# Altium project PWB.PrjPcb (part 2 of 3)

## Sheet EG8010.SchDoc: =DocumentName
size A4; Author: Starovit; CompanyName: "AS Manufacturing" LLC; Organization: "AS Manufacturing" LLC; Address1: 5 Sklyarenka St.; Address2: Kyiv 04073; Address3: Ukraine; Address4: https://ajax.systems/en/; Revision: v4; SheetNumber: 3; SheetTotal: 10; Product name: INVERTOR; Internal reference: 001; Head: INVERTOR.001.v4; PCB_Designator: INVERTOR.001.v4; Template_version: 1.0.1
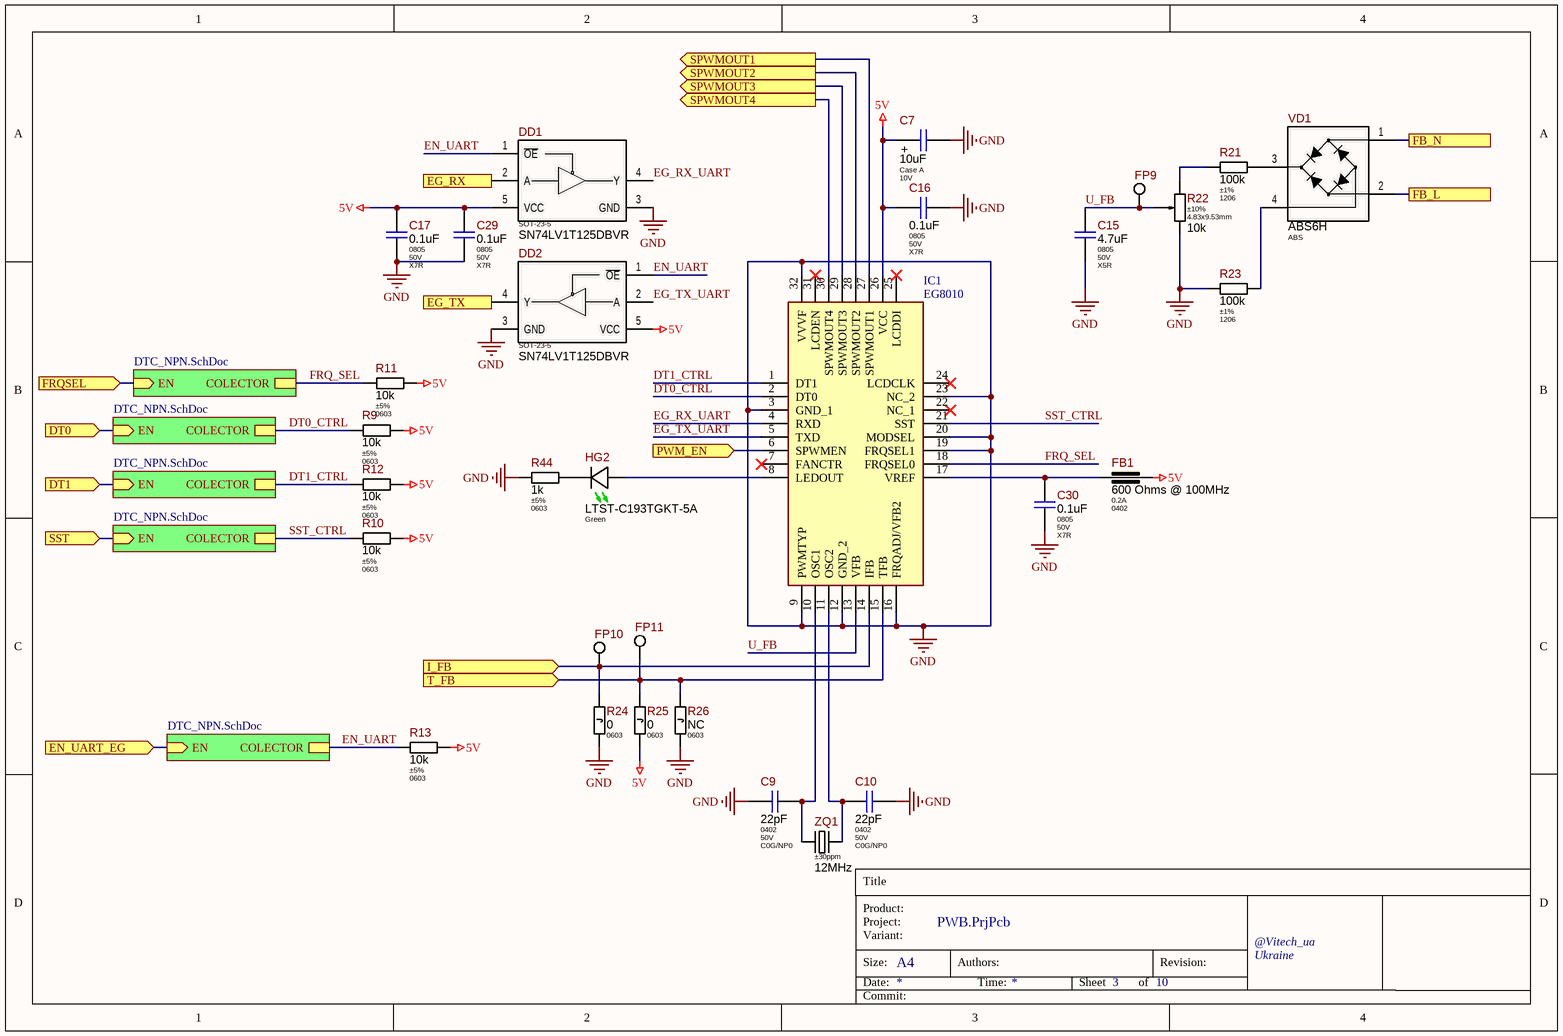
[diagram p2: EG8010.SchDoc]

### Parts
C7  Package: Case A  Voltage: 10V  [C_TANTAL_CASE_A_MED]  (hidden comment: 10uF)
C9  Package: 0402  Voltage: 50V  Dielectric Type: C0G/NP0  [C_CERAMIC_0402_MED]  (hidden comment: 22pF)
C10  Package: 0402  Voltage: 50V  Dielectric Type: C0G/NP0  [C_CERAMIC_0402_MED]  (hidden comment: 22pF)
C15  Package: 0805  Voltage: 50V  Dielectric Type: X5R  [C_CERAMIC_0805_MED]  (hidden comment: 4.7uF)
C16  Package: 0805  Voltage: 50V  Dielectric Type: X7R  [CAP-0805(2012)X85T10]  (hidden comment: 0.1uF)
C17  Package: 0805  Voltage: 50V  Dielectric Type: X7R  [CAP-0805(2012)X85T10]  (hidden comment: 0.1uF)
C29  Package: 0805  Voltage: 50V  Dielectric Type: X7R  [CAP-0805(2012)X85T10]  (hidden comment: 0.1uF)
C30  Package: 0805  Voltage: 50V  Dielectric Type: X7R  [CAP-0805(2012)X85T10]  (hidden comment: 0.1uF)
DD1  SN74LV1T125DBVR  [SOT-23-5]
DD2  SN74LV1T125DBVR  [SOT-23-5]
FB1  value 600 Ohms @ 100MHz  Current: 0.2A  Package: 0402  [BLM15xxxxxSN1x_MED]  (hidden comment: BLM15BD601SN1D)
FP9  PAD-1.75mm  [PAD-1.75mm]  (value not drawn)  (no BOM)
FP10  PAD-1.75mm  [PAD-1.75mm]  (value not drawn)  (no BOM)
FP11  PAD-1.75mm  [PAD-1.75mm]  (value not drawn)  (no BOM)
HG2  Color: Green  [LTST-C193xGKT-5A]  (hidden comment: LTST-C193TGKT-5A)
IC1  EG8010  [QFP80P900X900X160-32N]
R9  Tolerance: ±5%  Package: 0603  [R_ANY_CHIP_0603_MED]  (hidden comment: 10k)
R10  Tolerance: ±5%  Package: 0603  [R_ANY_CHIP_0603_MED]  (hidden comment: 10k)
R11  Tolerance: ±5%  Package: 0603  [R_ANY_CHIP_0603_MED]  (hidden comment: 10k)
R12  Tolerance: ±5%  Package: 0603  [R_ANY_CHIP_0603_MED]  (hidden comment: 10k)
R13  Tolerance: ±5%  Package: 0603  [R_ANY_CHIP_0603_MED]  (hidden comment: 10k)
R21  Tolerance: ±1%  Package: 1206  [R_ANY_CHIP_1206_MED]  (hidden comment: 100k)
R22  Tolerance: ±10%  Package: 4.83x9.53mm  [3296W-1-xxx]  (hidden comment: 10k)
R23  Tolerance: ±1%  Package: 1206  [R_ANY_CHIP_1206_MED]  (hidden comment: 100k)
R24  Package: 0603  [R_ANY_CHIP_0603_MED]  (hidden comment: 0)
R25  Package: 0603  [R_ANY_CHIP_0603_MED]  (hidden comment: 0)
R26  Package: 0603  [R_ANY_CHIP_0603_MED]  (hidden comment: NC)
R44  Tolerance: ±5%  Package: 0603  [R_ANY_CHIP_0603_MED]  (hidden comment: 1k)
VD1  Package: ABS  [ABSxx-Series]  (hidden comment: ABS6H)
ZQ1  Frequency Tolerance: ±30ppm  Frequency: 12MHz  [CSM4-Series]  (hidden comment: CSM4Z-A2B3C3-40-12.0D18)

### Sub-sheets
OC = DTC_NPN.SchDoc: EN (in), COLECTOR
OC = DTC_NPN.SchDoc: EN (in), COLECTOR
OC = DTC_NPN.SchDoc: EN (in), COLECTOR
OC = DTC_NPN.SchDoc: EN (in), COLECTOR
OC = DTC_NPN.SchDoc: EN (in), COLECTOR

### Ports
DT0 (in), DT1 (in), EG_RX (in), EG_TX (out), EN_UART_EG (in), FB_L, FB_N, FRQSEL (in), I_FB (in), PWM_EN (in), SPWMOUT1 (out), SPWMOUT2 (out), SPWMOUT3 (out), SPWMOUT4 (out), SST (in), T_FB (in)

### Nets
5V: C7.1 C16.1 C17.1 C29.1 DD1.5(VCC) DD2.5(VCC) FB1.1 IC1.26(VCC) R9.2 R10.2 R11.2 R12.2 R13.2 R25.2
GND: C7.2 C9.1 C10.2 C15.2 C16.2 C17.2 C29.2 C30.2 DD1.3(GND) DD2.3(GND) IC1.3(GND_1) IC1.9(PWMTYP) IC1.12(GND_2) IC1.16(FRQADJ/VFB2) IC1.19(FRQSEL1) IC1.20(MODSEL) IC1.23(NC_2) IC1.32(VVVF) R22.1(CCW) R23.1 R24.2 R26.2 R44.1
cEN_UART_EG: port EN_UART_EG, sheet OC/EN
DT0: port DT0, sheet OC/EN
DT0_CTRL: IC1.2(DT0) R9.1 ; sheet OC/COLECTOR
DT1: port DT1, sheet OC/EN
DT1_CTRL: IC1.1(DT1) R12.1 ; sheet OC/COLECTOR
EG_RX: DD1.2(A) ; port EG_RX
EG_RX_UART: DD1.4(Y) IC1.4(RXD)
EG_TX: DD2.4(Y) ; port EG_TX
EG_TX_UART: DD2.2(A) IC1.5(TXD)
EN_PWM: IC1.6(SPWMEN) ; port PWM_EN
EN_UART: DD1.1(~{OE}) DD2.1(~{OE}) R13.1 ; sheet OC/COLECTOR
FQSEL: port FRQSEL, sheet OC/EN
FRQ_SEL: IC1.18(FRQSEL0) R11.1 ; sheet OC/COLECTOR
NEUTRAL: VD1.2 ; port FB_L
SST: port SST, sheet OC/EN
SST_CTRL: IC1.21(SST) R10.1 ; sheet OC/COLECTOR
TR_OUT_L: VD1.1 ; port FB_N
U_FB: C15.1 FP9.1 IC1.13(VFB) R22.2(WIPER)
NetC9_2: C9.2 IC1.10(OSC1) ZQ1.2(XTAL2)
NetC10_1: C10.1 IC1.11(OSC2) ZQ1.1(XTAL1)
NetC30_1: C30.1 FB1.2 IC1.17(VREF)
NetDD3_4: IC1.29(SPWMOUT3) ; port SPWMOUT3
NetDD3_7: IC1.30(SPWMOUT4) ; port SPWMOUT4
NetDD3_9: IC1.27(SPWMOUT1) ; port SPWMOUT1
NetDD3_12: IC1.28(SPWMOUT2) ; port SPWMOUT2
NetFP10_1: FP10.1 IC1.14(IFB) R24.1 ; port I_FB
NetFP11_1: FP11.1 IC1.15(TFB) R25.1 R26.1 ; port T_FB
NetHG2_AN: HG2.AN(Anode) IC1.8(LEDOUT)
NetHG2_CA: HG2.CA(Cathode) R44.2
NetR21_1: R21.1 R22.3(CW)
NetR21_2: R21.2 VD1.3(+)
NetR23_2: R23.2 VD1.4(-)

Not connected (* = marked no-connect by the designer): IC1 7(FANCTR)* 22(NC_1)* 24(LCDCLK)* 25(LCDDI)* 31(LCDEN)*

### Notes on the sheet
- Title
- Product:
- Project:
- Size:
- Date:
- Variant:
- A4
- Authors:
- Time:
- Sheet
- of
- Revision:
- @Vitech_ua
- Commit:
- (in symbol 293D106X9010A2TE3) +

### Library data of the parts
C7 = 293D106X9010A2TE3: 10uF 10V ±10% Case A Tantalum Capacitor RoHS, 3.4Ohm; Manufacturer: Vishay; Ajax_1C_ID: 58999; Ajax_1C_PN: 10uF 10V case A Vishay 293D106X9010A2TE3 Tantalum Capacitor SMD RoHS; Ajax_1С_Status: RND Only; Standard Lead Time: 20 Weeks; Component Status: Released; Dielectric Type: NONE; GUID_1C: 304cf5a9-8da3-11ed-a366-005056994834; Value: 10uF; Part Number: 293D106X9010A2TE3; Part Type: Tantalum; Component Type: SMD; Temperature Range: -55°C ~ 125°C; Tolerance: ±10%; ComponentLink1URL: https://eu.mouser.com/datasheet/2/427/293d-1763499.pdf; Supplier 1: Mouser; Supplier Part Number 1: 74-293D106X9010A2TE3; Replacement: NONE; Price: 0,1; ComponentLink1Description: Datasheet
C9 C10 = CL05C220JB5NNNC: 22pF 50V NP0, C0G ±5% 0402 Ceramic Capacitor RoHS; Manufacturer: Samsung Electro-Mechanics; Ajax_1C_ID: 26744; Ajax_1C_PN: 22pF 50V COG 5% 0402 Samsung CL05C220JB5NNNC Ceramic Capacitor SMD RoHS; Ajax_1С_Status: Substitution; Standard Lead Time: 22 Weeks; Component Status: Released; Replacement: NONE; GUID_1C: 5b73e2ce-71ce-11eb-ab70-0050569f2651; Value: 22pF; Part Number: CL05C220JB5NNNC; Part Type: Ceramic / C0G(NP0) / 0402; Component Type: SMD; Temperature Range: -55°C ~ 125°C; Tolerance: ±5%; ComponentLink1URL: https://media.digikey.com/pdf/Data%20Sheets/Samsung%20PDFs/CL_Series_MLCC_ds.pdf; Supplier 1: Digi-Key; Supplier Part Number 1: 1276-1116-2-ND; Price: 0,0034; ComponentLink1Description: Datasheet
C15 = GRM21BR61H475KE51L: 4.7uF 50V X5R ±10% 0805 Ceramic Capacitor RoHS; Manufacturer: Murata Electronics; Ajax_1C_ID: 10966; Ajax_1C_PN: 4.7uF 50V X5R 10% 0805 GRM21BR61H475KE51L/CL21A475KBQNNNE Ceramic Capacitor SMD RoHS; Ajax_1С_Status: Mass Production; Standard Lead Time: 15 Weeks; Component Status: Released; Replacement: NONE; GUID_1C: c30c0b00-b370-11e7-8189-14dda9d2d04d; Value: 4.7uF; Part Number: GRM21BR61H475KE51L; Part Type: Ceramic / X5R / 0805; Component Type: SMD; Temperature Range: -55°C ~ 85°C; Tolerance: ±10%; ComponentLink1URL: https://search.murata.co.jp/Ceramy/image/img/A01X/G101/ENG/GRM21BR61H475KE51-01.pdf; Supplier 1: Digi-Key; Supplier Part Number 1: 490-10751-2-ND; Price: 0,0396; ComponentLink1Description: Datasheet
C16 C17 C29 C30 = CL21B104KBCNNNC: as C1 on sheet PWB; Value: 0.1uF; Part Number: CL21B104KBCNNNC; Part Type: Ceramic / X7R / 0805; Component Type: SMD; Temperature Range: -55°C ~ 125°C; Tolerance: ±10%; ComponentLink1URL: https://media.digikey.com/pdf/Data%20Sheets/Samsung%20PDFs/CL_Series_MLCC_ds.pdf; Supplier 1: Digi-Key; Supplier Part Number 1: 1276-1003-2-ND; Price: 0,00700031; ComponentLink1Description: Datasheet
DD1 DD2 = SN74LV1T125DBVR: Single Power Supply Single Buffer Gate with 3-State Output CMOS Logic Level Shifter, SOT-23-5; Manufacturer: Texas Instruments; Ajax_1C_ID: 37412; Ajax_1C_PN: SN74LV1T125DBVRG4 микросхема SOT-23-5 TI; Ajax_1С_Status: RND Only; Standard Lead Time: 35 Weeks; Component Status: On Review; Replacement: NONE; GUID_1C: 2979ae79-574b-11ec-a356-005056994834; Package: SOT-23-5; Part Number: SN74LV1T125DBVR; Part Type: Logic / Level Translator; Component Type: SMD; Temperature Range: -40°C ~ 125°C; ComponentLink1URL: https://www.ti.com/lit/ds/symlink/sn74lv1t125.pdf; Supplier 1: Digi-Key; Supplier Part Number 1: 296-37172-2-ND; Price: 0,386; ComponentLink1Description: Datasheet
FB1 = BLM15BD601SN1D: 600 Ohms @ 100MHz Power Line Ferrite Bead 0402, 200mA 650mOhm; Manufacturer: Murata Electronics; Ajax_1C_ID: 50383; Ajax_1C_PN: 600R BLM15BD601SN1D 0402 Murata Ferrite Bead; Ajax_1С_Status: RND Only; Saturation Current: NONE; Tolerance: ±25%; Component Status: Released; Standard Lead Time: 26 Weeks; GUID_1C: 598dd509-398f-11ed-a363-005056994834; Part Number: BLM15BD601SN1D; Part Type: Ferrite Bead; Component Type: SMD; Temperature Range: -55°C ~ 125°C; ComponentLink1URL: https://eu.mouser.com/datasheet/2/281/ENFA0018-1915754.pdf; Supplier 1: Mouser; Supplier Part Number 1: 81-BLM15BD601SN1D; Replacement: NONE; Price: 0,05; ComponentLink1Description: Datasheet
FP9-FP11 = PAD-1.75mm: 1.75mm Pad for Plug-In or Receptacle; Ajax_1C_PN: NONE; Ajax_1С_Status: RND Only; Component Status: Released; Part Number: PAD-1.75mm; Component Type: PTH; Manufacturer: NONE; Part Type: Pad; Temperature Range: NONE; ComponentLink1URL: NONE; Replacement: NONE; Price: NONE; ComponentLink1Description: Datasheet
HG2 = LTST-C193TGKT-5A: Indication LED, Green 525nm, Clear, SMD 0603, Vf 2.5V - 3.1V, 28 ~ 280mcd @ 5 mA, 130°; Manufacturer: Lite-On Optoelectronics; Ajax_1C_ID: 10369; Ajax_1C_PN: LTST-C193TGKT-5A Green SMD LED 0603 12mcd 5mA 130deg RoHS pcs; Ajax_1С_Status: Mass Production; Component Status: Released; Replacement: NONE; GUID_1C: 4b87c4c2-6263-11e7-811b-14dda9d2d04d; Part Number: LTST-C193TGKT-5A; Part Type: LED / 0603; Component Type: SMD; Package: 0603; Wavelength: 525nm; Temperature Range: -20°C ~ 80°C; ComponentLink1URL: https://media.digikey.com/pdf/Data%20Sheets/Lite-On%20PDFs/LTST-C193TGKT-5A.pdf; Supplier 1: Digi-Key; Supplier Part Number 1: 160-1832-2-ND; Price: 0,10177143; ComponentLink1Description: Datasheet
IC1 = EG8010: Integrated Circuit; Manufacturer_Name: Glenair; Datasheet Link: https://datasheetspdf.com/pdf-file/729849/EGMicro/EG8010/1; Height: 1.6mm; Manufacturer_Part_Number: EG8010
R9-R13 = RC0603JR-0710KL: 10 kOhms ±5%, 1/10W 0603 Thick Film Resistor; Manufacturer: Yageo; Ajax_1C_ID: 2860; Ajax_1C_PN: 10k 5% 0603 Resistors SMD RoHS; Ajax_1С_Status: Mass Production; Power Rating: 0.1W; Voltage: 75V; Component Status: Released; Temperature Stability: ±100ppm/°C; Replacement: NONE; GUID_1C: df4c2852-e567-11e2-9779-6c626deda1bb; Value: 10k; Part Number: RC0603JR-0710KL; Component Type: SMD; Part Type: Thick Film; Temperature Range: -55°C ~ 155°C; ComponentLink1URL: https://eu.mouser.com/datasheet/2/447/PYu_RC_Group_51_RoHS_L_10-1664068.pdf; Supplier 1: Digi-Key; Supplier Part Number 1: 311-10KGRTR-ND; Price: 0,0006; ComponentLink1Description: Datasheet
R21 R23 = RC1206FR-07100KL: 100 kOhms ±1%, 1/4W 1206 Thick Film Resistor; Manufacturer: Yageo; Ajax_1C_ID: 14373; Ajax_1C_PN: 100k 1% 1206 Resistors SMD RoHS; Ajax_1С_Status: Mass Production; Power Rating: 0.25W; Voltage: 200V; Component Status: Released; Temperature Stability: ±100ppm/°C; Replacement: NONE; GUID_1C: 93b23056-f3fc-11e8-ab4c-0050569f2651; Value: 100k; Part Number: RC1206FR-07100KL; Component Type: SMD; Part Type: Thick Film; Temperature Range: -55°C ~ 155°C; ComponentLink1URL: https://eu.mouser.com/datasheet/2/447/PYu_RC_Group_51_RoHS_L_10-1664068.pdf; Supplier 1: Digi-Key; Supplier Part Number 1: 311-100KFRTR-ND; Price: 0,00288; ComponentLink1Description: Datasheet
R22 = 3296W-1-103LF: 10 kOhms ±10% Trimmer Resistor, 0.5W, Through Hole 3/8", 4.83x9.53mm, 10.03mm Height; Manufacturer: Bourns; Ajax_1C_PN: NONE; Ajax_1С_Status: RND Only; Component Status: On Review; Temperature Stability: ±100ppm/°C; Value: 10k; Part Number: 3296W-1-103LF; Component Type: PTH; Part Type: Trimming Potentiometer; Power Rating: 0.5W; Temperature Range: -55°C ~ 125°C; ComponentLink1URL: https://www.bourns.com/data/global/pdfs/3296.pdf; Supplier 1: Mouser; Supplier Part Number 1: 652-3296W-1-103LF; Replacement: NONE; Price: NONE; ComponentLink1Description: Datasheet
R24-R26 = RC0603JR-070RL: 0 Ohms Jumper, 1/10W 0603 Thick Film Resistor; Manufacturer: Yageo; Tolerance: ±5%; Ajax_1C_ID: 2857; Ajax_1C_PN: 0R 5% 0603 Resistors SMD RoHS; Ajax_1С_Status: Mass Production; Power Rating: 0.1W; Voltage: 75V; Component Status: Released; Temperature Stability: NONE; GUID_1C: df4c284c-e567-11e2-9779-6c626deda1bb; Part Number: RC0603JR-070RL; Component Type: SMD; Part Type: Thick Film; Temperature Range: -55°C ~ 155°C; ComponentLink1URL: https://eu.mouser.com/datasheet/2/447/PYu_RC_Group_51_RoHS_L_10-1664068.pdf; Supplier 1: Digi-Key; Supplier Part Number 1: 311-0.0GRTR-ND; Replacement: NONE; Price: 0,0006; ComponentLink1Description: Datasheet
  R24 R25: Value: 0
  R26: Value: NC
R44 = RC0603JR-071KL: 1 kOhms ±5%, 1/10W 0603 Thick Film Resistor; Manufacturer: Yageo; Ajax_1C_ID: 28124; Ajax_1C_PN: 1k 5% 0603 Resistors SMD RoHS; Ajax_1С_Status: Mass Production; Power Rating: 0.1W; Voltage: 75V; Component Status: Released; Temperature Stability: ±100ppm/°C; Replacement: NONE; GUID_1C: fbc5fd6b-8d66-11eb-ab70-0050569f2651; Value: 1k; Part Number: RC0603JR-071KL; Component Type: SMD; Part Type: Thick Film; Temperature Range: -55°C ~ 155°C; ComponentLink1URL: https://eu.mouser.com/datasheet/2/447/PYu_RC_Group_51_RoHS_L_11-1984063.pdf; Supplier 1: Digi-Key; Supplier Part Number 1: 311-1.0KGRTR-ND; Price: 0,00072; ComponentLink1Description: Datasheet
VD1 = ABS6H: 1A, 600V Standard Bridge Rectifier, ABS Package; Manufacturer: Taiwan Semiconductor; Ajax_1C_ID: 34652; Ajax_1C_PN: ABS6H 600V 1A Bridge Rectifier LGE ABS; Ajax_1С_Status: RND Only; Component Status: Released; Vf: 0.95V @ 0.4A; Replacement: NONE; GUID_1C: 734c9af7-1f64-11ec-ab76-0050569f2651; Part Number: ABS6H; Part Type: Array; Component Type: SMD; Marking: ABS6H; Current: 1A; Voltage: 600V; Temperature Range: -55°C ~ 150°C; ComponentLink1URL: \\altiumdb.ajax.local\files\Datasheet\Diodes\ABS2 SERIES_M2103.pdf; Supplier 1: Mouser; Supplier Part Number 1: 821-ABS6H; Price: 0,0254; ComponentLink1Description: Datasheet
ZQ1 = CSM4Z-A2B3C3-40-12.0D18: 12MHz, 18pF, ±30ppm, 40Ohm ESR, 1mW DL Crystal Quartz; Manufacturer: Cardinal Components Inc.; Ajax_1C_ID: 28125; Ajax_1C_PN: 12.000 MHz 30ppm 18pF CSM4Z-A2B3C3-40-12.0D18 кварцевый резонатор; Ajax_1С_Status: RND Only; Component Status: Released; Standard Lead Time: 8 Weeks; Replacement: NONE; GUID_1C: 0d925abc-8d67-11eb-ab70-0050569f2651; Part Number: CSM4Z-A2B3C3-40-12.0D18; Part Type: Crystal; Component Type: SMD; Load Capacitance: 18pF; Frequency Stability: ±30ppm; Temperature Range: -40°C ~ 85 °C; ComponentLink1URL: https://www.cardinalxtal.com/uploads/files/csm4-csm5.pdf; Supplier 1: Digi-Key; Supplier Part Number 1: 370-1146-2-ND; Price: 0,505; ComponentLink1Description: Datasheet

## Sheet DTC_NPN.SchDoc: =DocumentName
size A4; Author: Starovit; CompanyName: "AS Manufacturing" LLC; Organization: "AS Manufacturing" LLC; Address1: 5 Sklyarenka St.; Address2: Kyiv 04073; Address3: Ukraine; Address4: https://ajax.systems/en/; Revision: v4; SheetNumber: 8; SheetTotal: 10; Product name: INVERTOR; Internal reference: 001; Head: INVERTOR.001.v4; PCB_Designator: INVERTOR.001.v4; Template_version: 1.0.1
Used 12 times, as channels EG/OC, EG/OC, EG/OC, EG/OC, EG/OC, GATE_DRIVER/OC, REVERSE_POL_PROT/OC, OCP/OC, OCP/OC, OC, Designator/OC, Designator/OC. Parts and nets are listed once, with the designators drawn on the sheet.
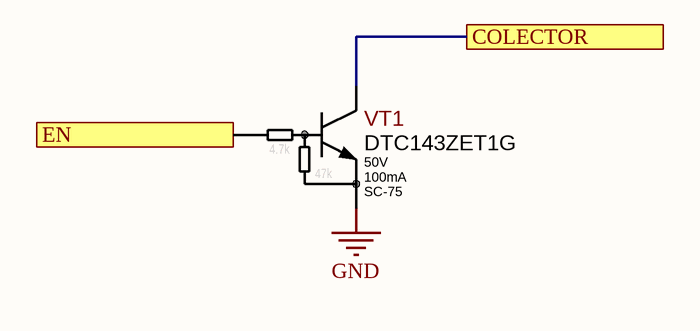
[diagram p3: DTC_NPN.SchDoc]

### Parts
VT1  Vce: 50V  Ic: 100mA  Package: SC-75  [SOT-416]  (hidden comment: DTC143ZET1G)

### Ports
COLECTOR, EN (in)

### Nets
GND: VT1.2(E)
COLECTOR: VT1.3(C) ; port COLECTOR
EN: VT1.1(B) ; port EN

### Channels
EG/OC: designators end in A; ports COLECTOR=DT0_CTRL EN=DT0
EG/OC: designators end in B; ports COLECTOR=DT1_CTRL EN=DT1
EG/OC: designators end in C; ports COLECTOR=SST_CTRL EN=SST
EG/OC: designators end in D; ports COLECTOR=FRQ_SEL EN=FQSEL
EG/OC: designators end in E; ports COLECTOR=EN_UART EN=cEN_UART_EG
GATE_DRIVER/OC: designators end in F; ports COLECTOR=NetDD3_15 EN=EN_PWM
REVERSE_POL_PROT/OC: designators end in G; ports COLECTOR=NetR42_1 EN=cEN_BRIDGE_POWER
OCP/OC: designators end in H; ports COLECTOR=EN_PWM_OCP EN=NetDD4_4
OCP/OC: designators end in I; ports COLECTOR=NetHG3_CA EN=NetDD4_4
OC: designators end in J; ports COLECTOR=NetK2_2 EN=cCONNECT_CHARGER
Designator/OC: designators end in K; ports COLECTOR=NetK1A_2 EN=cEN_220V_OUT
Designator/OC: designators end in L; ports COLECTOR=NetK1B_2 EN=cEN_BYPASS

### Notes on the sheet
- Title
- Product:
- Project:
- Size:
- Date:
- Variant:
- A4
- Authors:
- Time:
- Sheet
- of
- Revision:
- @Vitech_ua
- Commit:
- (in symbol DTC143ZET1G) 4.7k; 47k

### Library data of the parts
VT1 = DTC143ZET1G: 50V, 100mA Low Vce(sat) NPN Digital Transistor, Pre-Biased 4.7k/47k (with built-in resistors); Manufacturer: Onsemi; Ajax_1C_ID: 9410; Ajax_1C_PN: DTC143ZET1G SC-75-3  биполярный NPN транзистор; Ajax_1С_Status: Mass Production; Component Status: Released; Standard Lead Time: 8 Weeks; Replacement: NONE; GUID_1C: d76ac5d5-de69-11e6-829b-d8cb8a9acc66; Part Number: DTC143ZET1G; Part Type: NPN; Component Type: SMD; Temperature Range: -55°C ~ 150 °C; ComponentLink1URL: http://www.onsemi.com/pub/Collateral/DTC143Z-D.PDF; Supplier 1: Digi-Key; Supplier Part Number 1: DTC143ZET1GOSTR-ND; Price: 0,0125; ComponentLink1Description: Datasheet

## Sheet GATE_DRIVER.SchDoc: =DocumentName
size A4; Author: Starovit; CompanyName: "AS Manufacturing" LLC; Organization: "AS Manufacturing" LLC; Address1: 5 Sklyarenka St.; Address2: Kyiv 04073; Address3: Ukraine; Address4: https://ajax.systems/en/; Revision: v4; SheetNumber: 4; SheetTotal: 10; Product name: INVERTOR; Internal reference: 001; Head: INVERTOR.001.v4; PCB_Designator: INVERTOR.001.v4; Template_version: 1.0.1
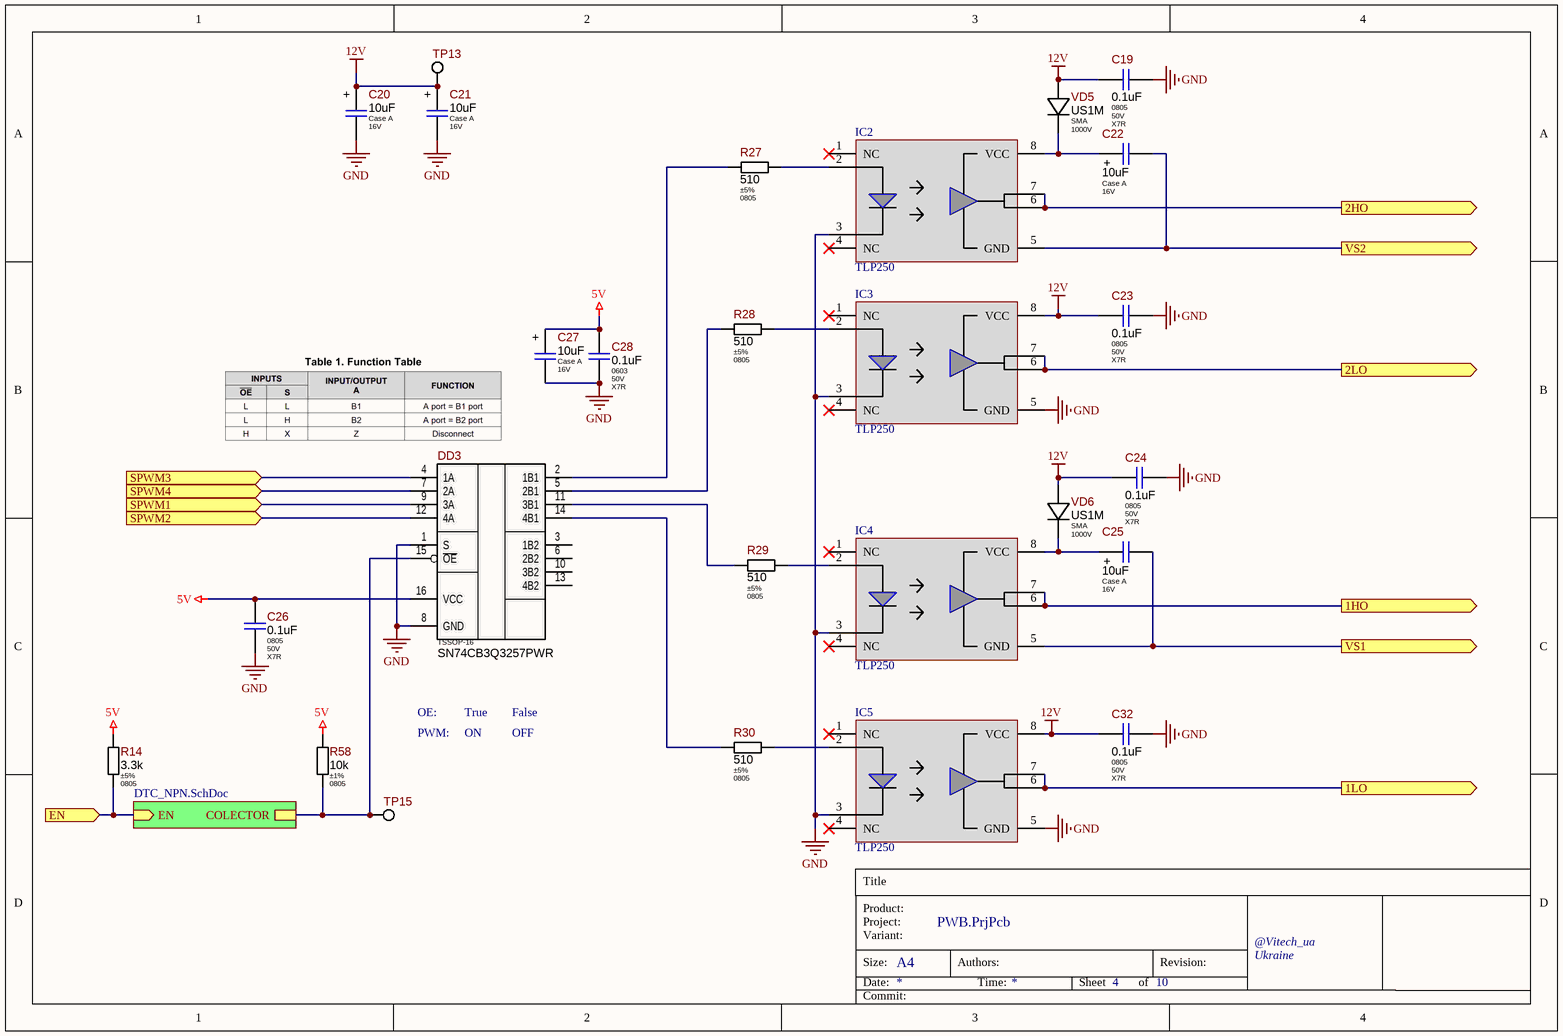
[diagram p4: GATE_DRIVER.SchDoc]

### Parts
C19  Package: 0805  Voltage: 50V  Dielectric Type: X7R  [CAP-0805(2012)X85T10]  (hidden comment: 0.1uF)
C20  Package: Case A  Voltage: 16V  [C_TANTAL_CASE_A_MED]  (hidden comment: 10uF)
C21  Package: Case A  Voltage: 16V  [C_TANTAL_CASE_A_MED]  (hidden comment: 10uF)
C22  Package: Case A  Voltage: 16V  [C_TANTAL_CASE_A_MED]  (hidden comment: 10uF)
C23  Package: 0805  Voltage: 50V  Dielectric Type: X7R  [CAP-0805(2012)X85T10]  (hidden comment: 0.1uF)
C24  Package: 0805  Voltage: 50V  Dielectric Type: X7R  [CAP-0805(2012)X85T10]  (hidden comment: 0.1uF)
C25  Package: Case A  Voltage: 16V  [C_TANTAL_CASE_A_MED]  (hidden comment: 10uF)
C26  Package: 0805  Voltage: 50V  Dielectric Type: X7R  [CAP-0805(2012)X85T10]  (hidden comment: 0.1uF)
C27  Package: Case A  Voltage: 16V  [C_TANTAL_CASE_A_MED]  (hidden comment: 10uF)
C28  Package: 0603  Voltage: 50V  Dielectric Type: X7R  [C_CERAMIC_0603_MED]  (hidden comment: 0.1uF)
C32  Package: 0805  Voltage: 50V  Dielectric Type: X7R  [CAP-0805(2012)X85T10]  (hidden comment: 0.1uF)
DD3  SN74CB3Q3257PWR  [TSSOP-16]
IC2  TLP250  [DIP762W60P254L966H485Q8N]
IC3  TLP250  [DIP762W60P254L966H485Q8N]
IC4  TLP250  [DIP762W60P254L966H485Q8N]
IC5  TLP250  [DIP762W60P254L966H485Q8N]
R14  Tolerance: ±5%  Package: 0805  [R_ANY_CHIP_0805_MED]  (hidden comment: 3.3k)
R27  Tolerance: ±5%  Package: 0805  [R_ANY_CHIP_0805_MED]  (hidden comment: 510)
R28  Tolerance: ±5%  Package: 0805  [R_ANY_CHIP_0805_MED]  (hidden comment: 510)
R29  Tolerance: ±5%  Package: 0805  [R_ANY_CHIP_0805_MED]  (hidden comment: 510)
R30  Tolerance: ±5%  Package: 0805  [R_ANY_CHIP_0805_MED]  (hidden comment: 510)
R58  Tolerance: ±1%  Package: 0805  [R_ANY_CHIP_0805_MED]  (hidden comment: 10k)
TP13  PAD-0.96mm  [PAD-0.96mm]  (value not drawn)  (no BOM)
TP15  PAD-0.96mm  [PAD-0.96mm]  (value not drawn)  (no BOM)
VD5  Package: SMA  Voltage: 1000V  [SMA_MED]  (hidden comment: US1M)
VD6  Package: SMA  Voltage: 1000V  [SMA_MED]  (hidden comment: US1M)

### Sub-sheets
OC = DTC_NPN.SchDoc: EN (in), COLECTOR

### Ports
1HO (out), 1LO (out), 2HO (out), 2LO (out), EN (in), SPWM1 (in), SPWM2 (in), SPWM3 (in), SPWM4 (in), VS1 (out), VS2 (out)

### Nets
5V: C26.1 C27.1 C28.2 DD3.16(VCC) R14.1 R58.2
12V: C19.1 C20.1 C21.1 C23.1 C24.1 C32.1 IC3.8(VCC) IC5.8(VCC) TP13.1 VD5.AN VD6.AN
GND: C19.2 C20.2 C21.2 C23.2 C24.2 C26.2 C27.2 C28.1 C32.2 DD3.1(S) DD3.8(GND) IC2.3(C) IC3.3(C) IC3.5(GND) IC4.3(C) IC5.3(C) IC5.5(GND)
EN_PWM: R14.2 ; port EN, sheet OC/EN
NetC22_1: C22.1 IC2.8(VCC) VD5.CA
NetC22_2: C22.2 IC2.5(GND) ; port VS2
NetC25_1: C25.1 IC4.8(VCC) VD6.CA
NetC25_2: C25.2 IC4.5(GND) ; port VS1
NetDD3_2: DD3.2(1B1) R27.1
NetDD3_4: DD3.4(1A) ; port SPWM3
NetDD3_5: DD3.5(2B1) R28.1
NetDD3_7: DD3.7(2A) ; port SPWM4
NetDD3_9: DD3.9(3A) ; port SPWM1
NetDD3_11: DD3.11(3B1) R29.1
NetDD3_12: DD3.12(4A) ; port SPWM2
NetDD3_14: DD3.14(4B1) R30.1
NetDD3_15: DD3.15(~{OE}) R58.1 TP15.1 ; sheet OC/COLECTOR
NetIC2_2: IC2.2(A) R27.2
NetIC2_6: IC2.6(VO_(OUTPUT)) IC2.7(VO) ; port 2HO
NetIC3_2: IC3.2(A) R28.2
NetIC3_6: IC3.6(VO_(OUTPUT)) IC3.7(VO) ; port 2LO
NetIC4_2: IC4.2(A) R29.2
NetIC4_6: IC4.6(VO_(OUTPUT)) IC4.7(VO) ; port 1HO
NetIC5_2: IC5.2(A) R30.2
NetIC5_6: IC5.6(VO_(OUTPUT)) IC5.7(VO) ; port 1LO

Not connected (* = marked no-connect by the designer): DD3 3(1B2) 6(2B2) 10(3B2) 13(4B2); IC2 1(NC)* 4(NC)*; IC3 1(NC)* 4(NC)*; IC4 1(NC)* 4(NC)*; IC5 1(NC)* 4(NC)*

### Notes on the sheet
- OE:
- True
- False
- PWM:
- ON
- OFF
- Title
- Product:
- Project:
- Size:
- Date:
- Variant:
- A4
- Authors:
- Time:
- Sheet
- of
- Revision:
- @Vitech_ua
- Commit:
- (in symbol TAJA106K016RNJ) +

### Library data of the parts
C19 C23 C24 C26 C32 = CL21B104KBCNNNC: as C1 on sheet PWB; Value: 0.1uF; Part Number: CL21B104KBCNNNC; Part Type: Ceramic / X7R / 0805; Component Type: SMD; Temperature Range: -55°C ~ 125°C; Tolerance: ±10%; ComponentLink1URL: https://media.digikey.com/pdf/Data%20Sheets/Samsung%20PDFs/CL_Series_MLCC_ds.pdf; Supplier 1: Digi-Key; Supplier Part Number 1: 1276-1003-2-ND; Price: 0,00700031; ComponentLink1Description: Datasheet
C20-C22 C25 C27 = TAJA106K016RNJ: 10uF 16V ±10% Case A Tantalum Capacitors, 3Ohm; Manufacturer: AVX; Ajax_1C_ID: 6332; Ajax_1C_PN: 10uF 16V case A TAJA106K016RNJ-AVX Ceramic Capacitor SMD RoHS; Ajax_1С_Status: RND Only; Standard Lead Time: 25 Weeks; Component Status: Released; Dielectric Type: NONE; GUID_1C: b7f6d7ac-ecab-11e4-ad28-a45d36c4a9e5; Value: 10uF; Part Number: TAJA106K016RNJ; Part Type: Tantalum; Component Type: SMD; Temperature Range: -55°C ~ 125°C; Tolerance: ±10%; ComponentLink1URL: https://eu.mouser.com/datasheet/2/40/AVXC_S_A0011957049_1-2538439.pdf; Supplier 1: Mouser; Supplier Part Number 1: 581-TAJA106K016R; Replacement: NONE; Price: 0,06584713; ComponentLink1Description: Datasheet
C28 = CL10B104KB8NNND: 100nF 50V X7R ±10% 0603 Ceramic Capacitor RoHS; Manufacturer: Samsung Electro-Mechanics; Ajax_1C_ID: 21313; Ajax_1C_PN: 100nF 50V X7R 10% 0603 CL10B104KB8NNND ceramic capacitor SMD; Ajax_1С_Status: Substitution; Standard Lead Time: 18 Weeks; Component Status: Released; Replacement: CL10B104KB8NNNC; GUID_1C: f1fd6399-ca68-11ea-ab63-0050569f2651; Value: 0.1uF; Part Number: CL10B104KB8NNND; Part Type: Ceramic / X7R / 0603; Component Type: SMD; Temperature Range: -55°C ~ 125°C; Tolerance: ±10%; ComponentLink1URL: https://media.digikey.com/pdf/Data%20Sheets/Samsung%20PDFs/CL_Series_MLCC_ds.pdf; Supplier 1: Digi-Key; Supplier Part Number 1: CL10B104KB8NNND-ND; Price: 0,0039378; ComponentLink1Description: Datasheet
DD3 = SN74CB3Q3257PWR: 4-Bit 1-of-2 FET Multiplexer/Demultiplexer 2.5V/3.3V Low-Voltage High-Bandwidth Bus Switch; Manufacturer: Texas Instruments; Ajax_1C_ID: 9738; Ajax_1C_PN: SN74CB3Q3257PWR микросхема; Ajax_1С_Status: RND Only; Standard Lead Time: 8 Weeks; Component Status: Released; Replacement: NONE; GUID_1C: ccf75652-0f3c-11e7-82d9-d8cb8a9acc66; Package: TSSOP-16; Part Number: SN74CB3Q3257PWR; Part Type: Logic / Multiplexer/Demultiplexer; Component Type: SMD; Temperature Range: -40°C ~ 85°C; ComponentLink1URL: http://www.ti.com/lit/ds/symlink/sn74cb3q3257.pdf; Supplier 1: Digi-Key; Supplier Part Number 1: 296-19138-1-ND; Price: 0,337; ComponentLink1Description: Datasheet
IC2-IC5 = TLP250: Integrated Circuit; Manufacturer_Name: Toshiba; Manufacturer_Part_Number: TLP250(F); Datasheet Link: https://pdf.voron.ua/files/pdf/optopara/tlp250.pdf; Height: 4.85mm; Mouser Part Number: 757-TLP250(F); Mouser Price/Stock: https://www.mouser.co.uk/ProductDetail/Toshiba/TLP250F?qs=f0GatGUIxV2cDxQrFeprhQ%3D%3D; Arrow Part Number: TLP250(F); Arrow Price/Stock: https://www.arrow.com/en/products/tlp250-f/toshiba
R14 = RC0805JR-073K3L: 3.3 kOhms ±5%, 1/8W 0805 Thick Film Resistor; Manufacturer: Yageo; Ajax_1C_ID: 9030; Ajax_1C_PN: 3.3k 5% 0805 Resistors SMD RoHS; Ajax_1С_Status: RND Only; Power Rating: 0.125W; Voltage: 150V; Component Status: Released; Temperature Stability: ±100ppm/°C; Replacement: NONE; GUID_1C: cb9785ec-9b47-11e6-8242-d8cb8a9acc66; Value: 3.3k; Part Number: RC0805JR-073K3L; Component Type: SMD; Part Type: Thick Film; Temperature Range: -55°C ~ 155°C; ComponentLink1URL: https://eu.mouser.com/datasheet/2/447/PYu_RC_Group_51_RoHS_L_10-1664068.pdf; Price: 0,001081; ComponentLink1Description: Datasheet
R27-R30 = CRCW0805510RJNEA: as R4 on sheet PWB; Value: 510; Part Number: CRCW0805510RJNEA; Component Type: SMD; Part Type: Thick Film; Temperature Range: -55°C ~ 155°C; ComponentLink1URL: https://eu.mouser.com/datasheet/2/427/dcrcwe3-1762152.pdf; Supplier 1: Mouser; Supplier Part Number 1: 71-CRCW0805510RJNEA; Price: 0,09; ComponentLink1Description: Datasheet
R58 = RC0805FR-0710K2L: 10 kOhms ±1%, 1/8W 0805 Thick Film Resistor; Manufacturer: Yageo; Ajax_1C_ID: 13943; Ajax_1C_PN: 10.2k 1% 0805 Resistors SMD RoHS; Ajax_1С_Status: Mass Production; Power Rating: 0.125W; Voltage: 150V; Component Status: Released; Temperature Stability: ±100ppm/°C; Replacement: NONE; GUID_1C: 8bc9d0ce-c58a-11e8-ab47-0050569f2651; Value: 10k; Part Number: RC0805FR-0710K2L; Component Type: SMD; Part Type: Thick Film; Temperature Range: -55°C ~ 155°C; ComponentLink1URL: https://eu.mouser.com/datasheet/2/447/PYu_RC_Group_51_RoHS_L_10-1664068.pdf; Supplier 1: Digi-Key; Supplier Part Number 1: 311-10.2KCRTR-ND; Price: 0,0014; ComponentLink1Description: Datasheet
TP13 TP15 = PAD-0.96mm: 0.96mm Pad for Plug-In or Receptacle; Ajax_1C_PN: NONE; Ajax_1С_Status: RND Only; Component Status: Released; Part Number: PAD-0.96mm; Component Type: PTH; Manufacturer: NONE; Part Type: Pad; Temperature Range: NONE; ComponentLink1URL: NONE; Replacement: NONE; Price: NONE; ComponentLink1Description: Datasheet
VD5 VD6 = US1M: Diode Standard 1000V 1A, 75ns, SMA; Manufacturer: Diodec Semiconductor; Ajax_1C_ID: 20461; Ajax_1C_PN: US1M-DIO 1.0A 1000V 75ns, диод; Ajax_1С_Status: Mass Production; Component Status: Released; Vf: 1.7V @ 1A; Replacement: NONE; GUID_1C: 3d137b04-96a6-11ea-ab61-0050569f2651; Part Number: US1M; Part Type: General; Component Type: SMD; Marking: US1M; Current: 1A; Temperature Range: -50°C ~ 150°C; ComponentLink1URL: https://diotec.com/request/datasheet/us1a.pdf; Supplier 1: Arrow; Supplier Part Number 1: US1M; Price: 0,02875902; ComponentLink1Description: Datasheet

## Sheet REVERSE_POLARITY_PROT.SchDoc: =DocumentName
size A4; Author: Starovit; CompanyName: "AS Manufacturing" LLC; Organization: "AS Manufacturing" LLC; Address1: 5 Sklyarenka St.; Address2: Kyiv 04073; Address3: Ukraine; Address4: https://ajax.systems/en/; Revision: v4; SheetNumber: 5; SheetTotal: 8; Product name: INVERTOR; Internal reference: 001; Head: INVERTOR.001.v4; PCB_Designator: INVERTOR.001.v4; Template_version: 1.0.1
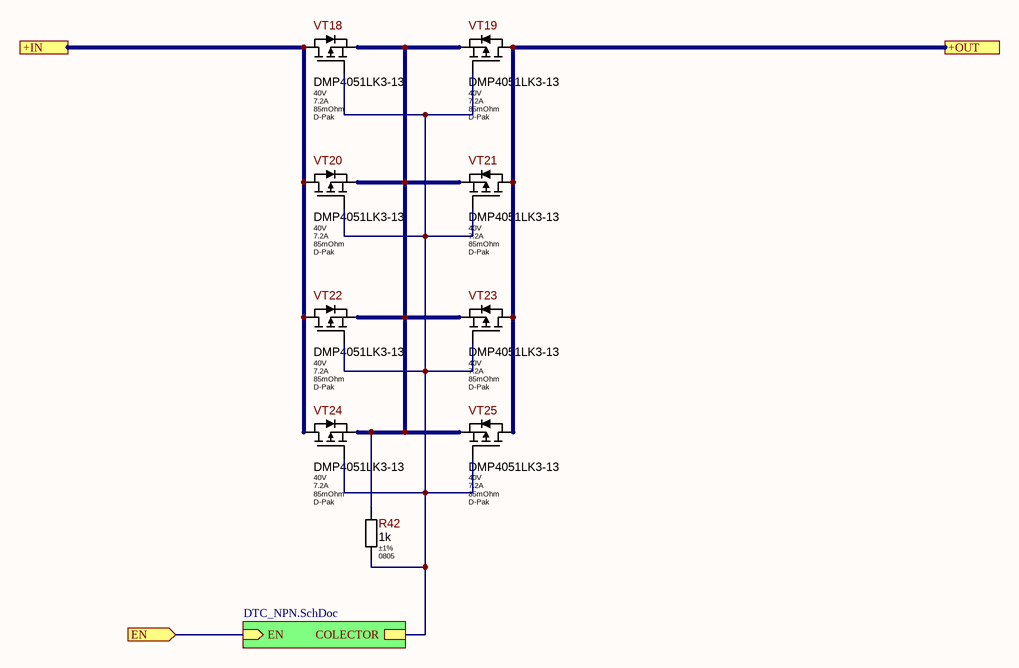
[diagram p5: REVERSE_POLARITY_PROT.SchDoc]

### Parts
R42  Tolerance: ±1%  Package: 0805  [R_ANY_CHIP_0805_MED]  (hidden comment: 1k)
VT18  Vds: 40V  Id: 7.2A  Rds: 85mOhm  Package: D-Pak  [DPAK_REC]  (hidden comment: DMP4051LK3-13)
VT19  Vds: 40V  Id: 7.2A  Rds: 85mOhm  Package: D-Pak  [DPAK_REC]  (hidden comment: DMP4051LK3-13)
VT20  Vds: 40V  Id: 7.2A  Rds: 85mOhm  Package: D-Pak  [DPAK_REC]  (hidden comment: DMP4051LK3-13)
VT21  Vds: 40V  Id: 7.2A  Rds: 85mOhm  Package: D-Pak  [DPAK_REC]  (hidden comment: DMP4051LK3-13)
VT22  Vds: 40V  Id: 7.2A  Rds: 85mOhm  Package: D-Pak  [DPAK_REC]  (hidden comment: DMP4051LK3-13)
VT23  Vds: 40V  Id: 7.2A  Rds: 85mOhm  Package: D-Pak  [DPAK_REC]  (hidden comment: DMP4051LK3-13)
VT24  Vds: 40V  Id: 7.2A  Rds: 85mOhm  Package: D-Pak  [DPAK_REC]  (hidden comment: DMP4051LK3-13)
VT25  Vds: 40V  Id: 7.2A  Rds: 85mOhm  Package: D-Pak  [DPAK_REC]  (hidden comment: DMP4051LK3-13)

### Sub-sheets
OC = DTC_NPN.SchDoc: EN (in), COLECTOR

### Ports
+IN, +OUT, EN (in)

### Nets
+V_BRIDGE: VT19.2(D) VT21.2(D) VT23.2(D) VT25.2(D) ; port +OUT
+VBAT: VT18.2(D) VT20.2(D) VT22.2(D) VT24.2(D) ; port +IN
cEN_BRIDGE_POWER: port EN, sheet OC/EN
NetR42_1: R42.1 VT18.1(G) VT19.1(G) VT20.1(G) VT21.1(G) VT22.1(G) VT23.1(G) VT24.1(G) VT25.1(G) ; sheet OC/COLECTOR
NetR42_2: R42.2 VT18.3(S) VT19.3(S) VT20.3(S) VT21.3(S) VT22.3(S) VT23.3(S) VT24.3(S) VT25.3(S)

### Notes on the sheet
- Title
- Product:
- Project:
- Size:
- Date:
- Variant:
- A4
- Authors:
- Time:
- Sheet
- of
- Revision:
- @Vitech_ua
- Commit:

### Library data of the parts
R42 = RC0805FR-071KL: 1 kOhms ±1%, 1/8W 0805 Thick Film Resistor; Manufacturer: Yageo; Ajax_1C_ID: 8520; Ajax_1C_PN: 1k 1% 0805 Resistors SMD RoHS; Ajax_1С_Status: Mass Production; Power Rating: 0.125W; Voltage: 150V; Component Status: Released; Temperature Stability: ±100ppm/°C; Replacement: NONE; GUID_1C: 0c53a8ec-2890-11e6-81ae-d8cb8a9acc66; Value: 1k; Part Number: RC0805FR-071KL; Component Type: SMD; Part Type: Thick Film; Temperature Range: -55°C ~ 155°C; ComponentLink1URL: https://eu.mouser.com/datasheet/2/447/PYu_RC_Group_51_RoHS_L_10-1664068.pdf; Supplier 1: Digi-Key; Supplier Part Number 1: 311-1.00KCRTR-ND; Price: 0,0014; ComponentLink1Description: Datasheet
VT18-VT25 = DMP4051LK3-13: -40V, -7.2A max P-Channel Enhancement MOSFET, 59mOhm @ Vgs = -4.5V; Manufacturer: Diodes Incorporated; Ajax_1C_ID: 18605; Ajax_1C_PN: DMP4051LK3 40V, 0,05Ohm P-chanel Power HEXFET; Ajax_1С_Status: Mass Production; Component Status: Released; Standard Lead Time: 30 Weeks; Replacement: NONE; GUID_1C: 9abe91dd-36a9-11ea-ab5a-0050569f2651; Part Number: DMP4051LK3-13; Part Type: P-Channel; Component Type: SMD; Temperature Range: -55°C ~ 150°C; ComponentLink1URL: https://www.diodes.com/assets/Datasheets/DMP4051LK3.pdf; Supplier 1: Digi-Key; Supplier Part Number 1: DMP4051LK3-13DITR-ND; Price: 0,1628; ComponentLink1Description: Datasheet

## Sheet EXT_U_DET.SchDoc: =DocumentName
size A4; Author: Starovit; CompanyName: "AS Manufacturing" LLC; Organization: "AS Manufacturing" LLC; Address1: 5 Sklyarenka St.; Address2: Kyiv 04073; Address3: Ukraine; Address4: https://ajax.systems/en/; Revision: v4; SheetNumber: 6; SheetTotal: 9; Product name: INVERTOR; Internal reference: 001; Head: INVERTOR.001.v4; PCB_Designator: INVERTOR.001.v4; Template_version: 1.0.1
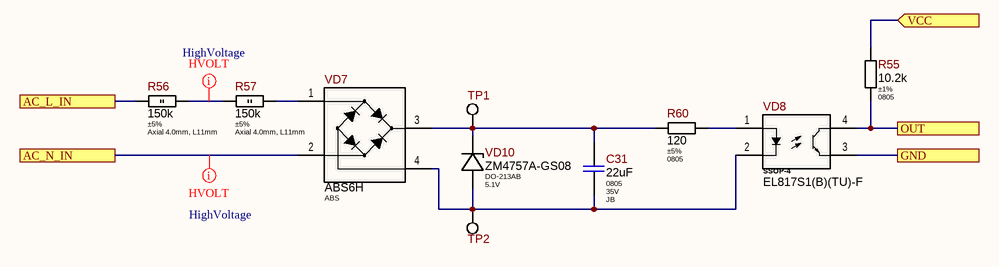
[diagram p6: EXT_U_DET.SchDoc]

### Parts
C31  Package: 0805  Voltage: 35V  Dielectric Type: JB  [CAP-0805(2012)X125T20]  (hidden comment: 22uF)
R55  Tolerance: ±1%  Package: 0805  [R_ANY_CHIP_0805_MED]  (hidden comment: 10.2k)
R56  Tolerance: ±5%  Package: Axial 4.0mm, L11mm  [MOR200S-Series]  (hidden comment: 150k)
R57  Tolerance: ±5%  Package: Axial 4.0mm, L11mm  [MOR200S-Series]  (hidden comment: 150k)
R60  Tolerance: ±5%  Package: 0805  [R_ANY_CHIP_0805_MED]  (hidden comment: 120)
TP1  PAD-0.96mm  [PAD-0.96mm]  (value not drawn)  (no BOM)
TP2  PAD-0.96mm  [PAD-0.96mm]  (value not drawn)  (no BOM)
VD7  Package: ABS  [ABSxx-Series]  (hidden comment: ABS6H)
VD8  Package: SSOP-4  [EL-817S1-(x)(xx)]  (hidden comment: EL817S1(B)(TU)-F)
VD10  Voltage: 5.1V  [DO-213AB]  (hidden comment: ZM4757A-GS08)

### Ports
AC_L_IN, AC_N_IN, GND, OUT, VCC (in)

### Nets
3V3: R55.1 ; port VCC
GND: VD8.3(Emitter) ; port GND
dEXT_U_DET: R55.2 VD8.4(Collector) ; port OUT
EXT_AC_L: R56.1 ; port AC_L_IN
NEUTRAL: VD7.2 ; port AC_N_IN
NetC31_1: C31.1 R60.1 TP1.1 VD7.3(+) VD10.CA
NetC31_2: C31.2 TP2.1 VD7.4(-) VD8.2(Cathode) VD10.AN
NetR56_2: R56.2 R57.1
NetR57_2: R57.2 VD7.1
NetR60_2: R60.2 VD8.1(Anode)

### Layout directives
net class HighVoltage: NetR56_2, NEUTRAL

### Notes on the sheet
- Title
- Product:
- Project:
- Size:
- Date:
- Variant:
- A4
- Authors:
- Time:
- Sheet
- of
- Revision:
- @Vitech_ua
- Commit:

### Library data of the parts
C31 = C2012JB1V226M125AC: 22uF 35V JB ±20% 0805 Ceramic Capacitor RoHS; Manufacturer: TDK Corporation; Ajax_1C_ID: 32073; Ajax_1C_PN: 22uF 35V 20% 0805 TDK C2012JB1V226M125AC Ceramic Capacitors RoHS; Ajax_1С_Status: RND Only; Standard Lead Time: 30 Weeks; Component Status: Released; Replacement: NONE; GUID_1C: 562d6396-e930-11eb-ab74-0050569f2651; Value: 22uF; Part Number: C2012JB1V226M125AC; Part Type: Ceramic / JB / 0805; Component Type: SMD; Temperature Range: -25°C ~ 85°C; Tolerance: ±20%; ComponentLink1URL: https://product.tdk.com/info/en/catalog/datasheets/mlcc_commercial_general_en.pdf; Supplier 1: Mouser; Supplier Part Number 1: 810-C2012JB1V226M12C; Price: 0,567; ComponentLink1Description: Datasheet
R55 = RC0805FR-0710K2L: 10.2 kOhms ±1%, 1/8W 0805 Thick Film Resistor; Manufacturer: Yageo; Ajax_1C_ID: 13943; Ajax_1C_PN: 10.2k 1% 0805 Resistors SMD RoHS; Ajax_1С_Status: Mass Production; Power Rating: 0.125W; Voltage: 150V; Component Status: Released; Temperature Stability: ±100ppm/°C; Replacement: NONE; GUID_1C: 8bc9d0ce-c58a-11e8-ab47-0050569f2651; Value: 10.2k; Part Number: RC0805FR-0710K2L; Component Type: SMD; Part Type: Thick Film; Temperature Range: -55°C ~ 155°C; ComponentLink1URL: https://eu.mouser.com/datasheet/2/447/PYu_RC_Group_51_RoHS_L_10-1664068.pdf; Supplier 1: Digi-Key; Supplier Part Number 1: 311-10.2KCRTR-ND; Price: 0,0014; ComponentLink1Description: Datasheet
R56 R57 = MOR200SJTB-10R: 150k Ohm ±5%, 2W d4.0mm L11mm Axial Through Hole, Metal Oxide Resistor, Al2O3; Manufacturer: Hitano; Ajax_1C_ID: 17914; Ajax_1C_PN: 150k 5% 2W (MOR200SJTB-10R-Hitano) резистор выводной pcs; Ajax_1С_Status: RND Only; Voltage: 500V; Component Status: Released; Temperature Stability: ±250ppm/°C; Replacement: NONE; GUID_1C: 857e103f-078d-11ea-ab58-0050569f2651; Value: 150k; Part Number: MOR200SJTB-10R; Component Type: PTH; Part Type: Metal Oxide Film; Power Rating: 2W; Temperature Range: -55°C ~ 200°C; ComponentLink1URL: \\altiumdb.ajax.local\files\Datasheet\Passive\MOR_20160329.pdf; Supplier 1: RKS; Supplier Part Number 1: 13878; Price: 0,05250406; ComponentLink1Description: Datasheet
R60 = ERJ-P06J121V: 120 Ohms ±5%, 1/2W 0805 Thick Film Resistor; Manufacturer: Yageo; Ajax_1C_ID: 19445; Ajax_1C_PN: 120R 5% 1/2W 0805 ERJ-P06J121V Panasonic Resistors SMD RoHS; Ajax_1С_Status: Mass Production; Power Rating: 0.5W; Voltage: 400V; Component Status: Released; Temperature Stability: ±200ppm/°C; Replacement: NONE; GUID_1C: e6cc71c1-57d9-11ea-ab5b-0050569f2651; Value: 120; Part Number: ERJ-P06J121V; Component Type: SMD; Part Type: Thick Film / Anti-Surge/Pulse Withstanding; Temperature Range: -55°C ~ 155°C; ComponentLink1URL: https://industrial.panasonic.com/cdbs/www-data/pdf/RDO0000/AOA0000C331.pdf; Supplier 1: Digi-Key; Supplier Part Number 1: P120ADTR-ND; Price: 0,02100084; ComponentLink1Description: Datasheet
TP1 TP2 = PAD-0.96mm: as TP13 on sheet GATE_DRIVER; Part Number: PAD-0.96mm; Component Type: PTH; Manufacturer: NONE; Part Type: Pad; Temperature Range: NONE; ComponentLink1URL: NONE; Replacement: NONE; Price: NONE; ComponentLink1Description: Datasheet
VD7 = ABS6H: as VD1 on sheet EG8010; Part Number: ABS6H; Part Type: Array; Component Type: SMD; Marking: ABS6H; Current: 1A; Voltage: 600V; Temperature Range: -55°C ~ 150°C; ComponentLink1URL: \\altiumdb.ajax.local\files\Datasheet\Diodes\ABS2 SERIES_M2103.pdf; Supplier 1: Mouser; Supplier Part Number 1: 821-ABS6H; Price: 0,0254; ComponentLink1Description: Datasheet
VD8 = EL817S1(B)(TU)-F: 1-Channel Photocoupler, 5kV, 130-260% CTR, SSOP-4; Manufacturer: Everlight Electronics; Ajax_1C_ID: 34526; Ajax_1C_PN: EL817S1(B)(TU)-F Optocoupler IC Everlight SMD-4; Ajax_1С_Status: RND Only; Component Status: On Review; Wavelength: NONE; GUID_1C: 2965953f-1c55-11ec-ab76-0050569f2651; ComponentLink1URL: \\altiumdb.ajax.local\files\Datasheet\Opto\el817-Everlight.pdf; ComponentLink1Description: Datasheet; Part Number: EL817S1(B)(TU)-F; Part Type: Optocoupler; Component Type: SMD; Color: NONE; Temperature Range: -55°C ~ 110°C; Supplier 1: Arrow; Supplier Part Number 1: EL817S1(B)(TU)-F; Replacement: NONE; Price: 0,04209091
VD10 = ZM4757A-GS08: Zener Diode 5.1V, 1W, ±5%, 5uA Reverse Current, DO-213AB; Manufacturer: Vishay Semiconductor; Ajax_1C_ID: 43362; Ajax_1C_PN: ZM4757A-GS08 стабилитрон 2,6*5,2 51V 1W; Ajax_1С_Status: Mass Production; Component Status: Released; Standard Lead Time: 27 Weeks; Replacement: NONE; GUID_1C: ea8fe24c-db72-11ec-a361-005056994834; Part Number: ZM4757A-GS08; Package: DO-213AB; Part Type: Zener; Component Type: SMD; Temperature Range: -65°C ~ 175°C; ComponentLink1URL: https://eu.mouser.com/datasheet/2/427/zm4728a-1767906.pdf; Supplier 1: Mouser; Supplier Part Number 1: 625-ZM4757A; Price: 0,07370924; ComponentLink1Description: Datasheet

## Sheet OCP.SchDoc: =DocumentName
size A4; Author: Starovit; CompanyName: "AS Manufacturing" LLC; Organization: "AS Manufacturing" LLC; Address1: 5 Sklyarenka St.; Address2: Kyiv 04073; Address3: Ukraine; Address4: https://ajax.systems/en/; Revision: v4; SheetNumber: 7; SheetTotal: 10; Product name: INVERTOR; Internal reference: 001; Head: INVERTOR.001.v4; PCB_Designator: INVERTOR.001.v4; Template_version: 1.0.1
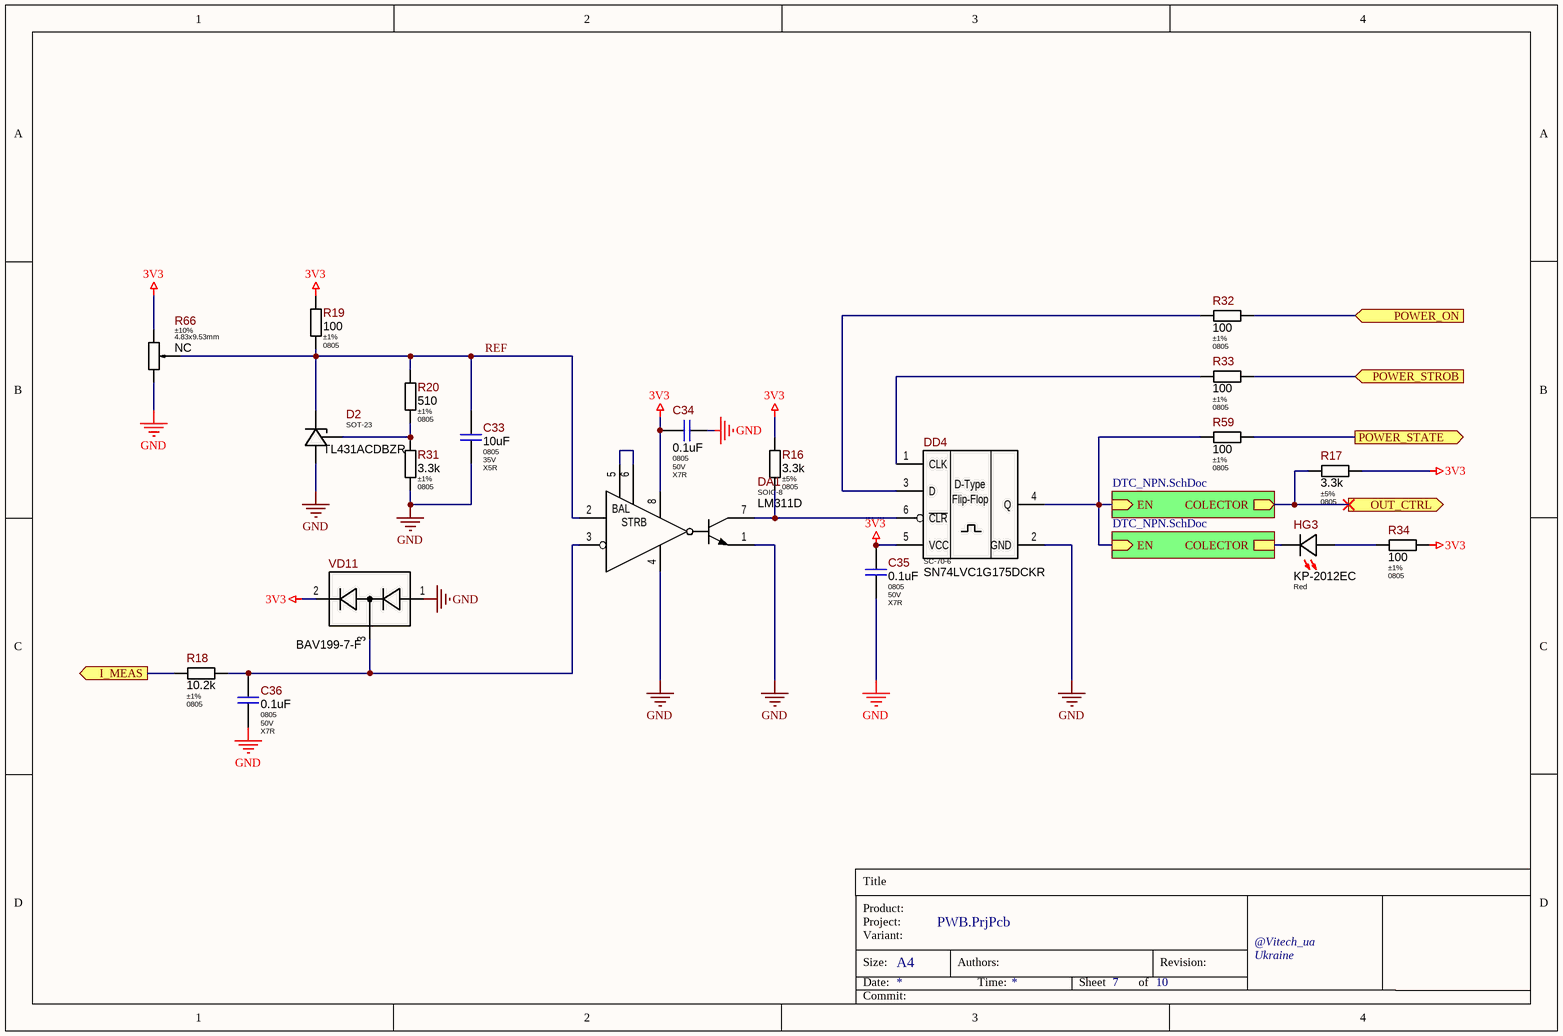
[diagram p7: OCP.SchDoc]

### Parts
C33  Package: 0805  Voltage: 35V  Dielectric Type: X5R  [CAP-0805(2012)X125T20]  (hidden comment: 10uF)
C34  Package: 0805  Voltage: 50V  Dielectric Type: X7R  [CAP-0805(2012)X85T10]  (hidden comment: 0.1uF)
C35  Package: 0805  Voltage: 50V  Dielectric Type: X7R  [CAP-0805(2012)X85T10]  (hidden comment: 0.1uF)
C36  Package: 0805  Voltage: 50V  Dielectric Type: X7R  [CAP-0805(2012)X85T10]  (hidden comment: 0.1uF)
D2  Package: SOT-23  [SOT-23_MED]  (hidden comment: TL431ACDBZR)
DA1  Package: SOIC-8  [SOIC-8_W3.9MM]  (hidden comment: LM311D)
DD4  SN74LVC1G175DCKR  [SC-70-6]
HG3  Color: Red  [KP-2012EC]  (hidden comment: KP-2012EC)
R16  Tolerance: ±5%  Package: 0805  [R_ANY_CHIP_0805_MED]  (hidden comment: 3.3k)
R17  Tolerance: ±5%  Package: 0805  [R_ANY_CHIP_0805_MED]  (hidden comment: 3.3k)
R18  Tolerance: ±1%  Package: 0805  [R_ANY_CHIP_0805_MED]  (hidden comment: 10.2k)
R19  Tolerance: ±1%  Package: 0805  [R_ANY_CHIP_0805_MED]  (hidden comment: 100)
R20  Tolerance: ±1%  Package: 0805  [R_ANY_CHIP_0805_MED]  (hidden comment: 510)
R31  Tolerance: ±1%  Package: 0805  [R_ANY_CHIP_0805_MED]  (hidden comment: 3.3k)
R32  Tolerance: ±1%  Package: 0805  [R_ANY_CHIP_0805_MED]  (hidden comment: 100)
R33  Tolerance: ±1%  Package: 0805  [R_ANY_CHIP_0805_MED]  (hidden comment: 100)
R34  Tolerance: ±1%  Package: 0805  [R_ANY_CHIP_0805_MED]  (hidden comment: 100)
R59  Tolerance: ±1%  Package: 0805  [R_ANY_CHIP_0805_MED]  (hidden comment: 100)
R66  Tolerance: ±10%  Package: 4.83x9.53mm  [3296W-1-xxx]  (hidden comment: NC)
VD11  BAV199-7-F  [SOT-23_MED]

### Sub-sheets
OC = DTC_NPN.SchDoc: EN (in), COLECTOR (out)
OC = DTC_NPN.SchDoc: EN (in), COLECTOR

### Ports
I_MEAS (out), OUT_CTRL (out), POWER_ON (in), POWER_STATE (out), POWER_STROB (in)

### Nets
3V3: C34.1 C35.1 DA1.8(VCC) DD4.5(VCC) R16.1 R17.1 R19.1 R34.2 R66.1(CCW) VD11.2
GND: C33.2 C34.2 C35.2 C36.2 D2.3(A) DA1.1(EMIT_OUT) DA1.4(GND) DD4.2(GND) R31.2 R66.3(CW) VD11.1
cPOWER_EN: R32.2 ; port POWER_ON
cPOWER_STROB: R33.2 ; port POWER_STROB
dPOWER_STATE: R59.2 ; port POWER_STATE
EN_PWM_OCP: R17.2 ; port OUT_CTRL, sheet OC/COLECTOR
REF: C33.1 D2.1(C) DA1.2(IN+) R19.2 R20.1 R66.2(WIPER)
xMEAS_CURRENT: R18.2 ; port I_MEAS
NetC36_1: C36.1 DA1.3(IN-) R18.1 VD11.3
NetD2_2: D2.2(REF) R20.2 R31.1
NetDA1_5: DA1.5(BALANCE) DA1.6(BAL/STRB)
NetDA1_7: DA1.7(COL_OUT) DD4.6(~{CLR}) R16.2
NetDD4_1: DD4.1(CLK) R33.1
NetDD4_3: DD4.3(D) R32.1
NetDD4_4: DD4.4(Q) R59.1 ; sheet OC/EN, sheet OC/EN
NetHG3_AN: HG3.AN(Anode) R34.1
NetHG3_CA: HG3.CA(Cathode) ; sheet OC/COLECTOR

### Notes on the sheet
- Title
- Product:
- Project:
- Size:
- Date:
- Variant:
- A4
- Authors:
- Time:
- Sheet
- of
- Revision:
- @Vitech_ua
- Commit:
- (in symbol LM311D) BAL; STRB
- (in symbol SN74LVC1G175DCKR) D-Type; Flip-Flop

### Library data of the parts
C33 = C2012X5R1V106K125AC: 10uF 35V X5R ±10% 0805 Low ESL Ceramic Capacitor RoHS; Manufacturer: TDK Corporation; Ajax_1C_ID: 29369; Ajax_1C_PN: 10uF 35V X5R 10% 0805 C2012X5R1V106K125AC TDK Ceramic Capacitor SMD RoHS; Ajax_1С_Status: Substitution; Standard Lead Time: 28 Weeks; Component Status: Released; Replacement: NONE; GUID_1C: b7f6aaac-a81d-11eb-ab74-0050569f2651; Value: 10uF; Part Number: C2012X5R1V106K125AC; Part Type: Ceramic / X5R / 0805; Component Type: SMD; Temperature Range: -55°C ~ 85°C; Tolerance: ±10%; ComponentLink1URL: https://product.tdk.com/system/files/dam/doc/product/capacitor/ceramic/mlcc/catalog/mlcc_commercial_general_en.pdf; Supplier 1: Digi-Key; Supplier Part Number 1: 445-14418-2-ND; Price: 0,04568564; ComponentLink1Description: Datasheet
C34-C36 = CL21B104KBCNNNC: 100nF 50V X7R ±10% 0805 Ceramic Capacitor RoHS; Manufacturer: Samsung Electro-Mechanics; Ajax_1C_ID: 1251; Ajax_1C_PN: 100nF 50V X7R 10% 0805 CL21B104KBCNNNC Ceramic Capacitor SMD RoHS; Ajax_1С_Status: Mass Production; Standard Lead Time: 22 Weeks; Component Status: Released; Replacement: NONE; GUID_1C: 2c368b99-dd41-11e0-af93-6c626deda1bb; Value: 0.1uF; Part Number: CL21B104KBCNNNC; Part Type: Ceramic / X7R / 0805; Component Type: SMD; Temperature Range: -55°C ~ 125°C; Tolerance: ±10%; ComponentLink1URL: https://media.digikey.com/pdf/Data%20Sheets/Samsung%20PDFs/CL_Series_MLCC_ds.pdf; Supplier 1: Digi-Key; Supplier Part Number 1: 1276-1003-2-ND; Price: 0,00700031; ComponentLink1Description: Datasheet
D2 = TL431ACDBZR: Adjustable Precision Shunt Regulator, Accuracy 1%,  SOT-23-3; Manufacturer: Texas Instruments; Ajax_1C_ID: 6287; Ajax_1C_PN: TL431ACDBZR (SOT-23); Ajax_1С_Status: Mass Production; Standard Lead Time: 8 Weeks; Component Status: Released; Replacement: NONE; GUID_1C: b426e85d-df70-11e4-9f89-a45d36c4a9e5; Part Number: TL431ACDBZR; Part Type: Voltage Reference; Component Type: SMD; Temperature Range: 0°C ~ 70°C; ComponentLink1URL: https://www.ti.com/lit/ds/symlink/tl431.pdf; Supplier 1: Digi-Key; Supplier Part Number 1: 296-17328-1-ND; Price: 0,0553; ComponentLink1Description: Datasheet
DA1 = LM311D: Differential General Purpose Comparator with Open-Collector, Open-Emitter, SOIC-8; Manufacturer: Texas Instruments; Ajax_1C_ID: 11065; Ajax_1C_PN: LM311D SO8, микросхема; Ajax_1С_Status: RND Only; Standard Lead Time: 6 Weeks; Component Status: On Review; Replacement: NONE; GUID_1C: 9c0f62f0-bfd1-11e7-8199-14dda9d2d04d; Part Number: LM311D; Part Type: Comparator; Component Type: SMD; Temperature Range: 0°C ~ 70°C; ComponentLink1URL: https://www.ti.com/lit/ds/symlink/lm311.pdf; Supplier 1: Digi-Key; Supplier Part Number 1: 296-1388-5-ND; Price: 0,2625203; ComponentLink1Description: Datasheet
DD4 = SN74LVC1G175DCKR: Single D-type Flip-Flop with Asynchronous Clear, Positive Edge Trigger, SC-70-6; Manufacturer: Texas Instruments; Ajax_1C_ID: 25389; Ajax_1C_PN: SN74LVC1G175DCKR (SC70-6) микросхема; Ajax_1С_Status: RND Only; Standard Lead Time: 6 Weeks; Component Status: On Review; Replacement: NONE; GUID_1C: 0fcd2c69-53fe-11eb-ab6e-0050569f2651; Package: SC-70-6; Part Number: SN74LVC1G175DCKR; Part Type: Logic / Flip-Flop; Component Type: SMD; Temperature Range: -40°C ~ 125°C; ComponentLink1URL: https://www.ti.com/lit/ds/symlink/sn74lvc1g175.pdf; Supplier 1: Digi-Key; Supplier Part Number 1: 296-16998-2-ND; Price: 0,0382; ComponentLink1Description: Datasheet
HG3 = KP-2012EC: Low Power LED, Red 617nm, SMD, Vf 2V, 15mcd @ 20 mA, 160°; Manufacturer: Kingbright; Ajax_1C_ID: 1424; Ajax_1C_PN: Светодиоды 0805 SMD красные / KP-2012EC / BL-HS135A-AV-TRB; Ajax_1С_Status: Mass Production; Component Status: Released; Replacement: NONE; GUID_1C: 254df8b6-dd50-11e0-af93-6c626deda1bb; Part Number: KP-2012EC; Part Type: LED / 0805; Component Type: SMD; Package: 0805; Wavelength: 617nm; Temperature Range: -40°C ~ 85°C; ComponentLink1URL: \\altiumdb.ajax.local\files\Datasheet\Opto\KP-2012EC.pdf; Supplier 1: Farnell; Supplier Part Number 1: 8529949; Price: 0,02786; ComponentLink1Description: Datasheet
R16 R17 R31 = RC0805JR-073K3L: 3.3 kOhms ±5%, 1/8W 0805 Thick Film Resistor; Manufacturer: Yageo; Ajax_1C_ID: 9030; Ajax_1C_PN: 3.3k 5% 0805 Resistors SMD RoHS; Ajax_1С_Status: RND Only; Power Rating: 0.125W; Voltage: 150V; Component Status: Released; Temperature Stability: ±100ppm/°C; Replacement: NONE; GUID_1C: cb9785ec-9b47-11e6-8242-d8cb8a9acc66; Value: 3.3k; Part Number: RC0805JR-073K3L; Component Type: SMD; Part Type: Thick Film; Temperature Range: -55°C ~ 155°C; ComponentLink1URL: https://eu.mouser.com/datasheet/2/447/PYu_RC_Group_51_RoHS_L_10-1664068.pdf; Price: 0,001081; ComponentLink1Description: Datasheet
R18 = RC0805FR-0710K2L: 10.2 kOhms ±1%, 1/8W 0805 Thick Film Resistor; Manufacturer: Yageo; Ajax_1C_ID: 13943; Ajax_1C_PN: 10.2k 1% 0805 Resistors SMD RoHS; Ajax_1С_Status: Mass Production; Power Rating: 0.125W; Voltage: 150V; Component Status: Released; Temperature Stability: ±100ppm/°C; Replacement: NONE; GUID_1C: 8bc9d0ce-c58a-11e8-ab47-0050569f2651; Value: 10.2k; Part Number: RC0805FR-0710K2L; Component Type: SMD; Part Type: Thick Film; Temperature Range: -55°C ~ 155°C; ComponentLink1URL: https://eu.mouser.com/datasheet/2/447/PYu_RC_Group_51_RoHS_L_10-1664068.pdf; Supplier 1: Digi-Key; Supplier Part Number 1: 311-10.2KCRTR-ND; Price: 0,0014; ComponentLink1Description: Datasheet
R19 R32-R34 R59 = RC0805JR-073K3L: 3.3 kOhms ±5%, 1/8W 0805 Thick Film Resistor; Part Number: RC0805JR-07100; Manufacturer: Yageo; Ajax_1C_ID: 9030; Ajax_1C_PN: 100 5% 0805 Resistors SMD RoHS; Ajax_1С_Status: RND Only; Power Rating: 0.125W; Voltage: 150V; Component Status: Released; Temperature Stability: ±100ppm/°C; Replacement: NONE; GUID_1C: cb9785ec-9b47-11e6-8242-d8cb8a9acc66; Value: 100; Component Type: SMD; Part Type: Thick Film; Temperature Range: -55°C ~ 155°C; ComponentLink1URL: https://eu.mouser.com/datasheet/2/447/PYu_RC_Group_51_RoHS_L_10-1664068.pdf; Price: 0,001081; ComponentLink1Description: Datasheet
R20 = CRCW0805510RJNEA: 510 Ohms ±5%, 1/8W 0805 Thick Film Resistor; Manufacturer: Vishay; Ajax_1C_ID: 9454; Ajax_1C_PN: 510R 5% 0805 Resistors SMD RoHS; Ajax_1С_Status: RND Only; Power Rating: 0.125W; Voltage: 150V; Component Status: Released; Temperature Stability: ±200ppm/°C; Replacement: NONE; GUID_1C: 51b8dd24-e3a6-11e6-82a2-d8cb8a9acc66; Value: 510; Part Number: CRCW0805510RJNEA; Component Type: SMD; Part Type: Thick Film; Temperature Range: -55°C ~ 155°C; ComponentLink1URL: https://eu.mouser.com/datasheet/2/427/dcrcwe3-1762152.pdf; Supplier 1: Mouser; Supplier Part Number 1: 71-CRCW0805510RJNEA; Price: 0,09; ComponentLink1Description: Datasheet
R66 = 3296W-1-103LF: 10 kOhms ±10% Trimmer Resistor, 0.5W, Through Hole 3/8", 4.83x9.53mm, 10.03mm Height; Manufacturer: Bourns; Ajax_1C_PN: NONE; Ajax_1С_Status: RND Only; Component Status: On Review; Temperature Stability: ±100ppm/°C; Value: NC; Part Number: 3296W-1-103LF; Component Type: PTH; Part Type: Trimming Potentiometer; Power Rating: 0.5W; Temperature Range: -55°C ~ 125°C; ComponentLink1URL: https://www.bourns.com/data/global/pdfs/3296.pdf; Supplier 1: Mouser; Supplier Part Number 1: 652-3296W-1-103LF; Replacement: NONE; Price: NONE; ComponentLink1Description: Datasheet
VD11 = BAV199-7-F: Diode Array 1 Pair Series Connection Standard 85V 160mA, 5nA Reverse Current, SOT-23; Manufacturer: Diodes Incorporated; Ajax_1C_ID: 25391; Ajax_1C_PN: BAV199-7-F (SOT-23) диод; Ajax_1С_Status: RND Only; Marking: K52; Component Status: Released; Standard Lead Time: 30 Weeks; Vf: 1.25V @ 150 mA; Replacement: NONE; GUID_1C: 0951ac93-5400-11eb-ab6e-0050569f2651; Voltage: 85V; Part Number: BAV199-7-F; Part Type: Array; Component Type: SMD; Package: SOT-23; Current: 160mA; Temperature Range: -65°C ~ 150°C; ComponentLink1URL: https://eu.mouser.com/datasheet/2/115/DIOD_S_A0008363444_1-2543096.pdf; Supplier 1: Mouser; Supplier Part Number 1: 621-BAV199-F; Price: 0,022; ComponentLink1Description: Datasheet

## Sheet RELAY.SchDoc
size A4; SheetNumber: 9; SheetTotal: 9
Used 2 times, as channels Designator, Designator. Parts and nets are listed once, with the designators drawn on the sheet.
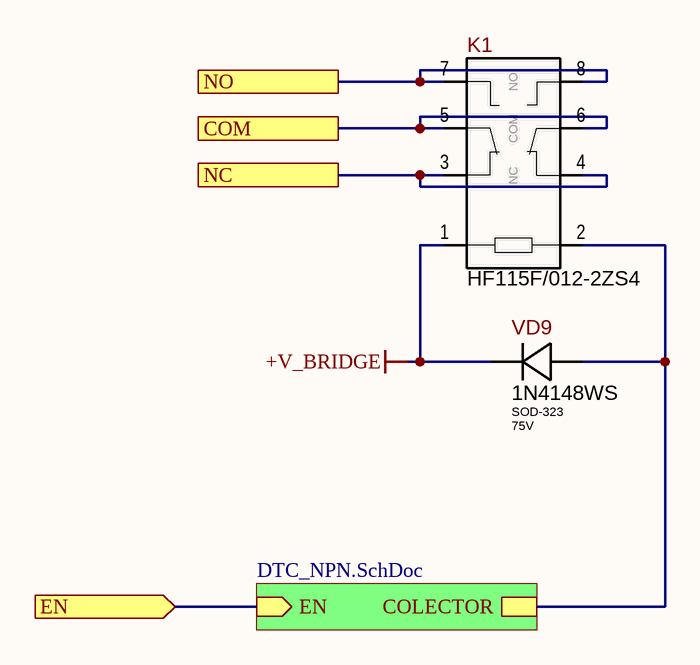
[diagram p8: RELAY.SchDoc]

### Parts
K1  HF115F/012-2ZS4  [HF115Fxxx-1(2)Zx3(4)]
VD9  Package: SOD-323  Voltage: 75V  [SOD-323_MED]  (hidden comment: 1N4148WS)

### Sub-sheets
OC = DTC_NPN.SchDoc: EN (in), COLECTOR

### Ports
COM, EN (in), NC, NO

### Nets
+V_BRIDGE: K1.1(COIL1) VD9.CA
COM: K1.5(1-COM) K1.6(2-COM) ; port COM
EN: port EN, sheet OC/EN
NC: K1.3(1-NC) K1.4(2-NC) ; port NC
NO: K1.7(2-NO) K1.8(2-NO) ; port NO
NetK1_2: K1.2(COIL2) VD9.AN ; sheet OC/COLECTOR

### Channels
Designator: designators end in A; ports COM=NetK1A_5 EN=cEN_220V_OUT NC=NetK1A_3 NO=TR_OUT_L
Designator: designators end in B; ports COM=NetK1A_5 EN=cEN_BYPASS NC=NetK1B_3 NO=EXT_AC_L

### Notes on the sheet
- Title
- Product:
- Project:
- Size:
- Date:
- Variant:
- A4
- Authors:
- Time:
- Sheet
- of
- Revision:
- @Vitech_ua
- Commit:
- (in symbol HF115F/012-2ZS4) NO; COM; NC

### Library data of the parts
K1 = HF115F/012-2ZS4: Miniature High Power Relay, DPDT (2 Form C), 12VDC 400mW Coil, 5.0mm 2 Pole 8A AgCdO; Manufacturer: Hongfa; Ajax_1C_ID: 38428; Ajax_1C_PN: HF115F/012-2ZS4 HONGFA, Реле; Ajax_1С_Status: RND Only; Component Status: Released; Replacement: NONE; GUID_1C: 4ba44618-64be-11ec-a90c-00505699469b; Part Number: HF115F/012-2ZS4; Part Type: Relay; Component Type: PTH; Temperature Range: -40°C ~ 85°C; ComponentLink1URL: https://www.tme.eu/Document/2962d862af219292e2e76bbc4b5ef3a2/hf115f.pdf; Supplier 1: TME; Supplier Part Number 1: HF115F/012-2ZS4; Price: 2,02140634; ComponentLink1Description: Datasheet
VD9 = 1N4148WS: Diode Standard 75V 150mA, SOD-323F; Manufacturer: Diodec Semiconductor; Ajax_1C_ID: 10255; Ajax_1C_PN: 1N4148WS diotec SOD-323; Ajax_1С_Status: Mass Production; Marking: W2; Component Status: Released; Standard Lead Time: NONE; Vf: 1V @ 50mA; Replacement: 1N4148WS-E; GUID_1C: 3d8ac204-519f-11e7-8106-14dda9d2d04d; Part Type: Fast Switching; Component Type: SMD; Current: 150mA; Temperature Range: -55°C ~ 150°C; ComponentLink1URL: https://diotec.com/tl_files/diotec/files/pdf/datasheets/1n4148ws.pdf; Supplier 1: TME; Supplier Part Number 1: 1N4148WS-DIO; Price: 0,00864; ComponentLink1Description: Datasheet; Part Number: 1N4148WS